# EAGLE design B Bot Cube (EAGLE 7.2.0)
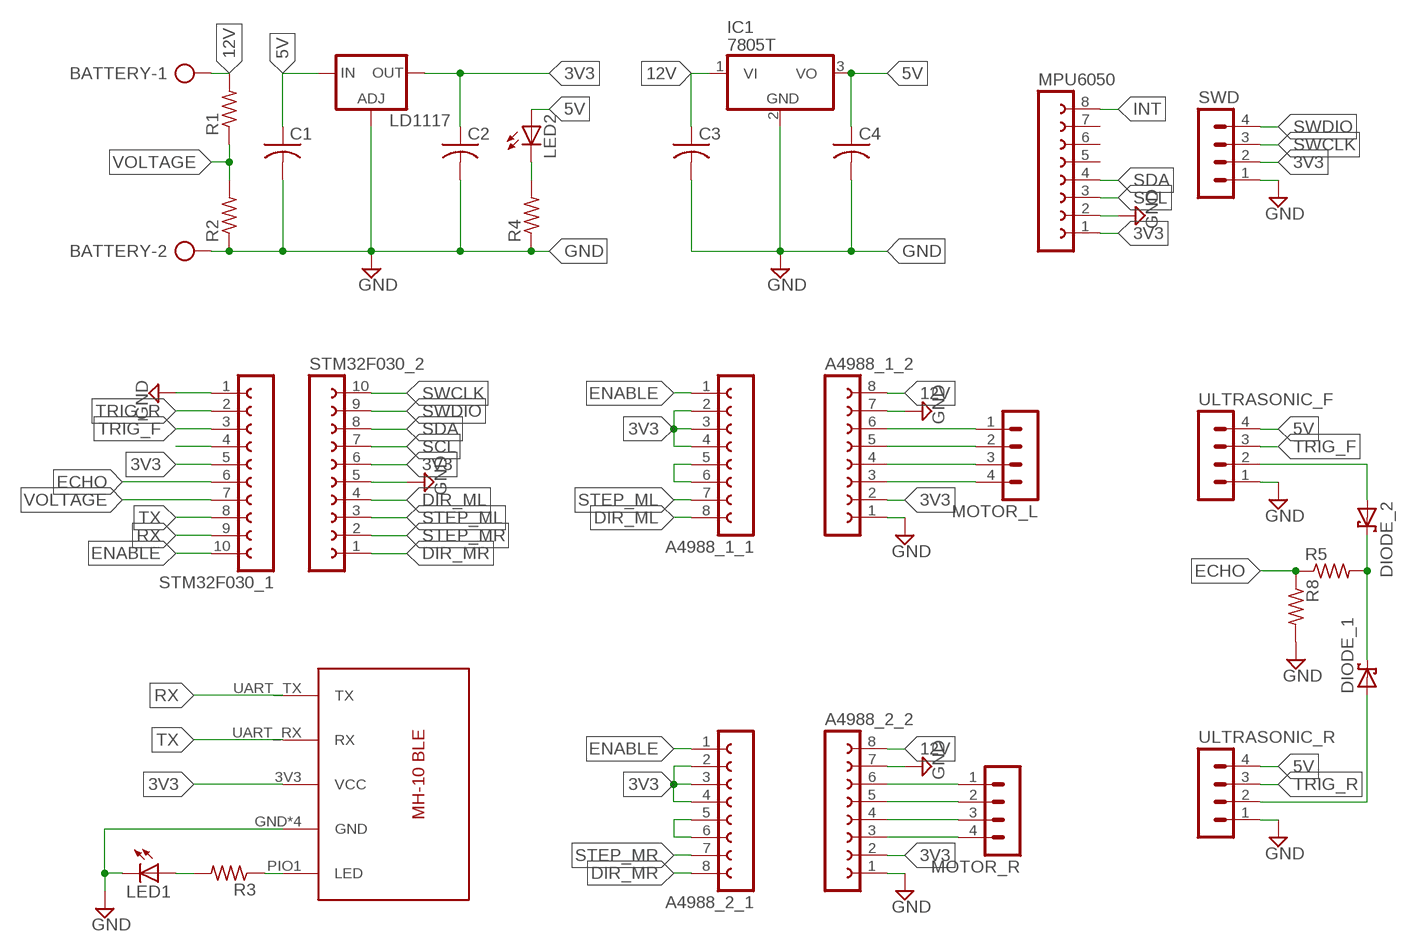
[diagram p0: schematic, sheet 1]

## Parts
A4988_1_1  FE08-1  [FE08]
A4988_1_2  FE08-1  [FE08]
A4988_2_1  FE08-1  [FE08]
A4988_2_2  FE08-1  [FE08]
BATTERY  AK500/2  [AK500/2]
C1  C-USC0805K  [C0805K]
C2  C-USC0805K  [C0805K]
C3  C-USC0805K  [C0805K]
C4  C-USC0805K  [C0805K]
DIODE_1  BAT60J  [SOD323_ST]
DIODE_2  BAT60J  [SOD323_ST]
IC1  7805T  [TO220H]
LD1117  LD117AS33TR  [SOT223]
LED1  LED-0805  [LED-805]
LED2  LED-0805  [LED-805]
MOTOR_L  MA04-1  [MA04-1]
MOTOR_R  MA04-1  [MA04-1]
MPU6050  FE08-1  [FE08]
R1  R-US_M0805  [M0805]
R2  R-US_M0805  [M0805]
R3  R-US_M0805  [M0805]
R4  R-US_M0805  [M0805]
R5  R-US_M0805  [M0805]
R8  R-US_M0805  [M0805]
STM32F030_1  FE10-1  [FE10]
STM32F030_2  FE10-1  [FE10]
SWD  MA04-1  [MA04-1]
U$1  HM-10  [HM-10]
ULTRASONIC_F  MA04-1  [MA04-1]
ULTRASONIC_R  MA04-1  [MA04-1]

## Nets
3V3: A4988_1_1.2 A4988_1_1.3 A4988_1_1.4 A4988_1_2.2 A4988_2_1.2 A4988_2_1.3 A4988_2_1.4 A4988_2_2.2 C2.1 LD1117.4(OUT) MPU6050.1 STM32F030_1.5 STM32F030_2.6 SWD.2 U$1.3V3(VCC)
5V: C1.1 C4.1 IC1.3(VO) LD1117.3(IN) LED2.A ULTRASONIC_F.4 ULTRASONIC_R.4
12V: A4988_1_2.8 A4988_2_2.8 BATTERY.1 C3.1 IC1.1(VI) R1.2
DIR_ML: A4988_1_1.8 STM32F030_2.4
DIR_MR: A4988_2_1.8 STM32F030_2.1
ECHO: R5.1 R8.1 STM32F030_1.6
ENABLE: A4988_1_1.1 A4988_2_1.1 STM32F030_1.10
GND: A4988_1_2.1 A4988_1_2.7 A4988_2_2.1 A4988_2_2.7 BATTERY.2 C1.2 C2.2 C3.2 C4.2 IC1.2(GND) LD1117.1(ADJ) LED1.C MPU6050.2 R2.1 R4.1 R8.2 STM32F030_1.1 STM32F030_2.5 SWD.1 U$1.GND U$1.GND2(GND) U$1.GND3(GND) U$1.GND4(GND) ULTRASONIC_F.1 ULTRASONIC_R.1
INT: MPU6050.8
N$2: DIODE_1.A ULTRASONIC_R.2
N$3: DIODE_2.A ULTRASONIC_F.2
N$4: DIODE_1.C DIODE_2.C R5.2
N$5: LED2.C R4.2
N$7: LED1.A R3.2
N$8: R3.1 U$1.PIO1(LED)
N$22: A4988_2_1.5 A4988_2_1.6
N$26: A4988_2_2.6 MOTOR_R.1
N$27: A4988_2_2.5 MOTOR_R.2
N$28: A4988_2_2.4 MOTOR_R.3
N$29: A4988_2_2.3 MOTOR_R.4
N$30: A4988_1_2.6 MOTOR_L.1
N$31: A4988_1_2.5 MOTOR_L.2
N$32: A4988_1_2.4 MOTOR_L.3
N$33: A4988_1_2.3 MOTOR_L.4
N$45: A4988_1_1.5 A4988_1_1.6
N$60: STM32F030_1.4
RX: STM32F030_1.9 U$1.UART_TX(TX)
SCL: MPU6050.3 STM32F030_2.7
SDA: MPU6050.4 STM32F030_2.8
STEP_ML: A4988_1_1.7 STM32F030_2.3
STEP_MR: A4988_2_1.7 STM32F030_2.2
SWCLK: STM32F030_2.10 SWD.3
SWDIO: STM32F030_2.9 SWD.4
TRIG_F: STM32F030_1.3 ULTRASONIC_F.3
TRIG_R: STM32F030_1.2 ULTRASONIC_R.3
TX: STM32F030_1.8 U$1.UART_RX(RX)
VOLTAGE: R1.1 R2.2 STM32F030_1.7
Unconnected: MPU6050.5 MPU6050.6 MPU6050.7

## Library data of the parts
A4988_1_1 A4988_1_2 A4988_2_1 A4988_2_2 MPU6050 = con-lsta:FE08-1: FEMALE HEADER; OC_FARNELL: unknown; OC_NEWARK: unknown
BATTERY = con-ptr500:AK500/2: CONNECTOR; OC_FARNELL: unknown; OC_NEWARK: unknown
C1-C4 = rcl:C-US: CAPACITOR, American symbol
DIODE_1 DIODE_2 = diode:BAT60J: Schottky barrier diode Source: www.st.com, BAT60J.pdf
IC1 = linear:78*: Positive VOLTAGE REGULATOR Source: http://cache.national.com/ds/LM/LM78L05.pdf http://www.fairchildsemi.com/ds/LM/LM7805.pdf
LD1117 = v-reg:LD117A?*: Low drop fixed and adjustable positive voltage regulators 1 A Source: http://www.st.com/stonline/products/literature/ds/7194/ld1117axx.pdf
LED1 LED2 = dp_devices:LED: Light Emitting Diode
MOTOR_L MOTOR_R SWD ULTRASONIC_F ULTRASONIC_R = con-lstb:MA04-1: PIN HEADER; OC_FARNELL: unknown; OC_NEWARK: unknown
R1-R5 R8 = resistor:R-US_: RESISTOR, American symbol
STM32F030_1 STM32F030_2 = con-lsta:FE10-1: FEMALE HEADER; OC_FARNELL: unknown; OC_NEWARK: unknown
U$1 = Kao_lbr:HM-10

## Board
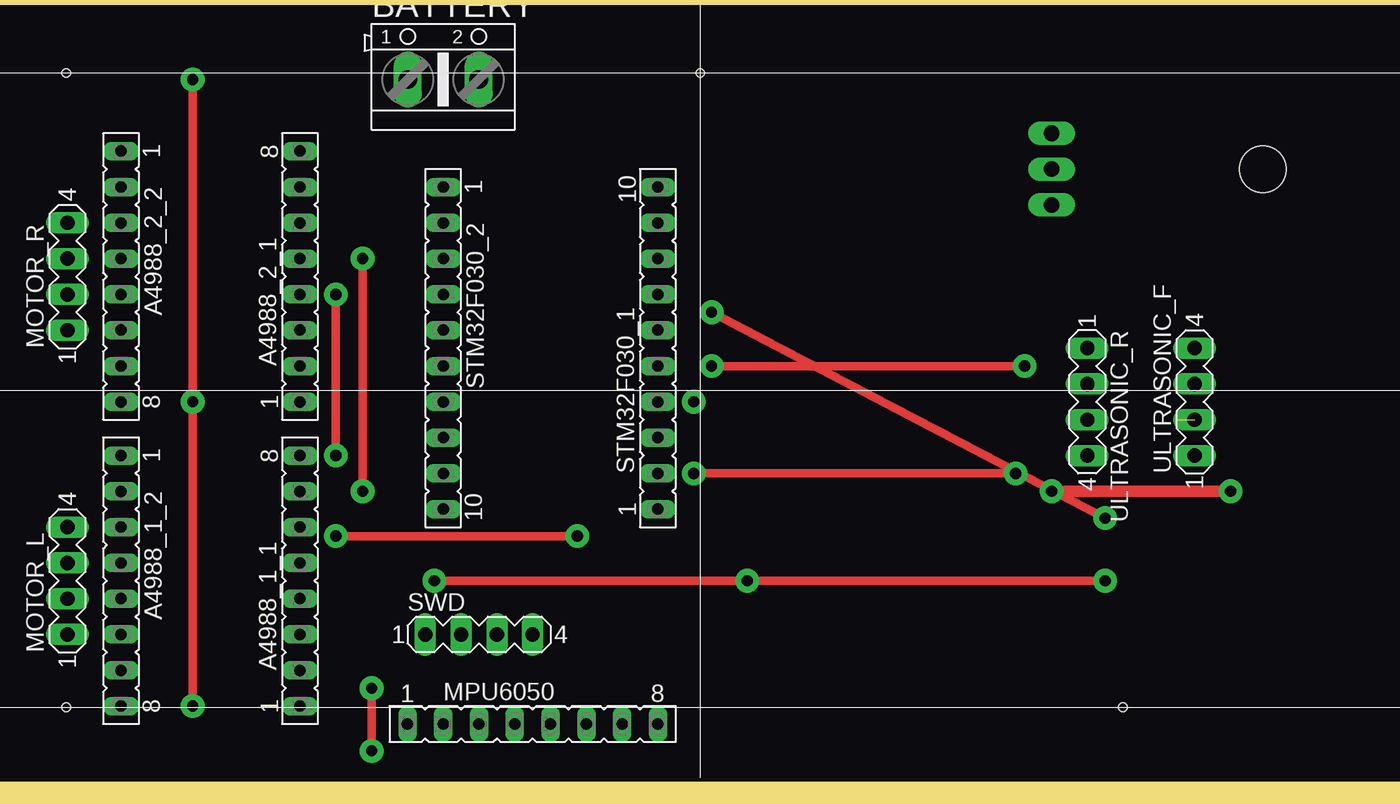
[diagram p1: board, top side]
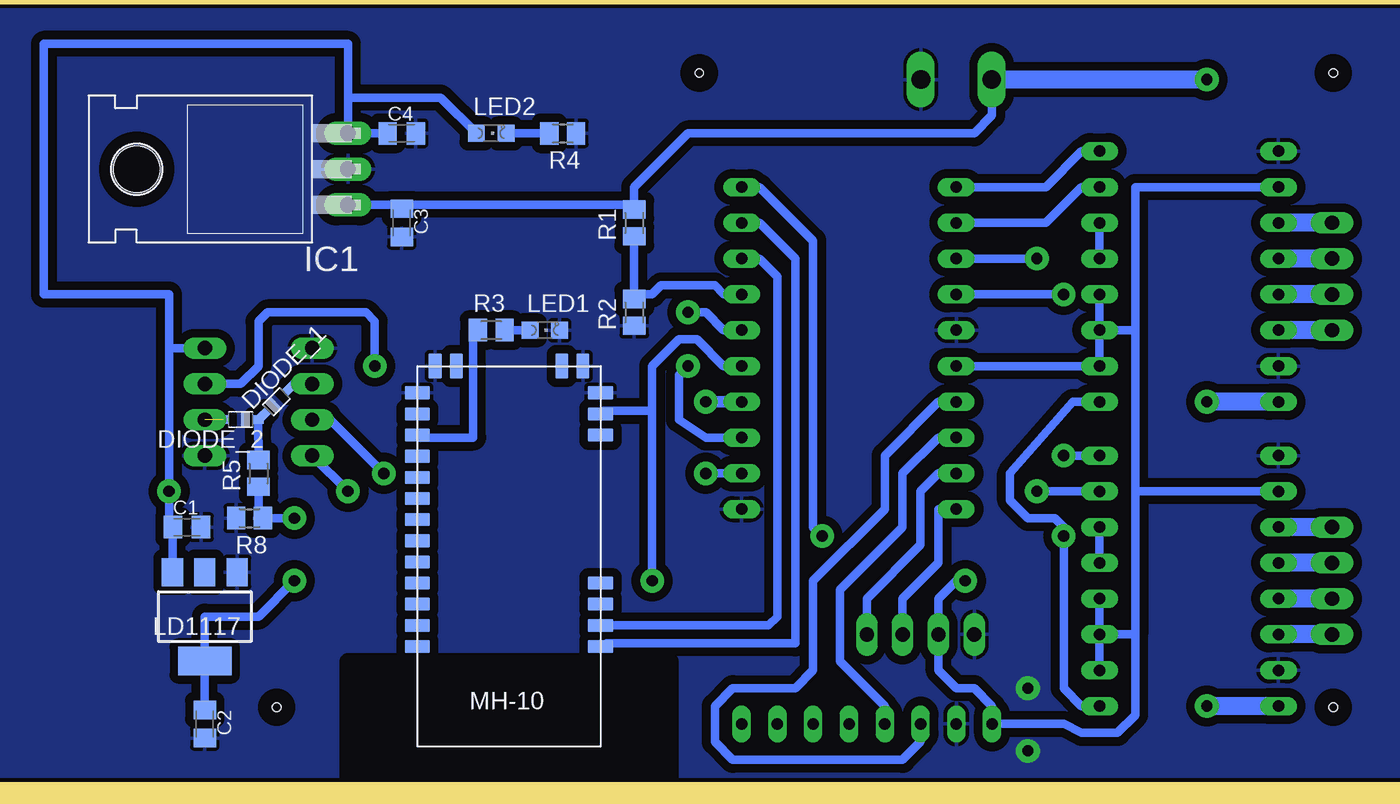
[diagram p2: board, bottom side, seen from below]

No outline drawn. Coordinates in mm, seen from the top.
Copper layers (1*16): Top 0.035mm / dielectric 1.5mm / Bottom 0.035mm
Design rules "default": minimum track width 10mil, minimum drill 24mil, track to track 8mil, track to pad 8mil, pad to pad 8mil, via to via 8mil, smd to smd 8mil, copper to edge 40mil, drill to drill 8mil, minimum pad ring 10mil, minimum via ring 8mil, stop-mask expansion 4mil, vias tented up to drill 0mil, thermal gap 10mil
Holes 0.6 mm at 50,50 5,50 80,5 5,5
bRestrict: area 52.1,-0.6 to 74.9,8.3
Milling: 4 lines

### Footprints (pad centres in the part's own frame; a part is rotated, then mirrored left to right if it is on the bottom)
FE08 = drill 0.813 long: 1 -8.89,0; 2 -6.35,0; 3 -3.81,0; 4 -1.27,0; 5 1.27,0; 6 3.81,0; 7 6.35,0; 8 8.89,0
AK500/2 = drill 1.321 long: 1 -2.515,0; 2 2.515,0
C0805K = smd 1.3 x 1.6: 1 -1,0; 2 1,0
SOD323_ST = smd 0.8 x 0.6: A 1.25,0; C -1.25,0
TO220H = drill 1.118 long: 1 -2.54,-10.16; 2 0,-10.16; 3 2.54,-10.16 | hole 3.302: 0,4.826
SOT223 = smd 1.5 x 2: 1 -2.3,-3.15; 2 0,-3.15; 3 2.3,-3.15 | smd 3.8 x 2: 4 0,3.15
LED-805 = smd 1.2 x 1.2: A 0,-1.05; C 0,1.05
MA04-1 = drill 1.016 long: 1 -3.81,0; 2 -1.27,0; 3 1.27,0; 4 3.81,0
M0805 = smd 1.3 x 1.6: 1 -0.95,0; 2 0.95,0
FE10 = drill 0.813 long: 1 -11.43,0; 2 -8.89,0; 3 -6.35,0; 4 -3.81,0; 5 -1.27,0; 6 1.27,0; 7 3.81,0; 8 6.35,0; 9 8.89,0; 10 11.43,0
HM-10 = smd 1.778 x 0.914: 3V3 -6.5,3.4; GND -6.5,1.9; GND4 6.5,1.9; PIO0 6.5,3.4; PIO1 6.5,4.9; PIO2 6.5,6.4; PIO3 6.5,7.9; PIO4 6.5,9.4; PIO5 6.5,10.9; PIO6 6.5,12.4; PIO7 6.5,13.9; PIO8 6.5,15.4; PIO9 6.5,16.9; PIO10 6.5,18.4; PIO11 6.5,19.9; RESETB -6.5,4.9; UART_CTS -6.5,16.9; UART_RTS -6.5,15.4; UART_RX -6.5,18.4; UART_TX -6.5,19.9 | smd 0.914 x 1.778: GND2 -5.25,0; GND3 5.25,0; USB_D+ 3.75,0; USB_D- -3.75,0

### Placement (x,y rotation side)
A4988_1_1  21.59,13.97 90 top
A4988_1_2  8.89,13.97 270 top
A4988_2_1  21.59,35.56 90 top
A4988_2_2  8.89,35.56 270 top
BATTERY  31.75,49.53 0 top
C1  86.36,17.78 0 bottom
C2  85.09,3.81 270 bottom
C3  71.12,39.37 270 bottom
C4  71.12,45.72 0 bottom
DIODE_1  80.01,26.67 45 bottom
DIODE_2  82.55,25.4 180 bottom
IC1  85.09,43.18 90 bottom
LD1117  85.09,11.43 180 bottom
LED1  60.96,31.75 270 bottom
LED2  64.77,45.72 270 bottom
MOTOR_L  5.08,13.97 90 top
MOTOR_R  5.08,35.56 90 top
MPU6050  38.1,3.81 0 top
R1  54.61,39.37 90 bottom
R2  54.61,33.02 90 bottom
R3  64.77,31.75 0 bottom
R4  59.69,45.72 180 bottom
R5  81.28,21.59 90 bottom
R8  81.92,18.41 180 bottom
STM32F030_1  46.99,30.48 90 top
STM32F030_2  31.75,30.48 270 top
SWD  34.29,10.16 0 top
U$1  63.5,29.21 180 bottom
ULTRASONIC_F  85.09,26.67 90 top
ULTRASONIC_R  77.47,26.67 270 top

### Tracks (layer width: path | path; a pad name or v marks a point on that pad's centre or on a via)
3V3  (via drill 0.8 pad 1.68)
  Top 0.61: v78.74,13.97 v53.34,13.97 v31.11,13.97
  Bottom 0.61: A4988_2_1.4 A4988_2_1.3 | A4988_2_1.3 A4988_2_1.2 STM32F030_2.6 | A4988_1_1.4 A4988_1_1.3 | A4988_1_1.3 A4988_1_1.2 | A4988_2_2.2 19.05,41.91 19.05,31.75 | A4988_1_2.2 19.05,20.32 | 19.05,20.32 19.05,10.16 | 19.05,20.32 19.05,31.75 | 19.05,31.75 A4988_2_1.3 | 19.05,10.16 A4988_1_1.3 | 19.05,10.16 19.05,4.45 20.32,3.17 22.86,3.17 24.13,3.81 MPU6050.1 29.21,5.08 30.48,6.35 31.75,6.35 33.02,7.62 SWD.2 33.02,12.7 31.75,13.97 v31.11,13.97 | C2.1 LD1117.4 85.09,11.43 81.28,11.43 v78.74,13.97 | STM32F030_1.5 48.26,29.21 50.16,31.11 51.44,31.11 53.34,29.21 53.34,26.04 | 53.34,26.04 v53.34,13.97 | U$1.3V3 56.77,26.04 53.34,26.04
5V  (via drill 0.8 pad 1.68)
  Top 0.813: v74.93,20.32 v87.63,20.32
  Bottom 0.61: 74.93,48.26 IC1.3 C4.1 | 74.93,48.26 74.93,52.07 96.52,52.07 96.52,34.29 87.63,34.29 87.63,30.48 | 87.63,30.48 ULTRASONIC_F.4 | LD1117.3 87.36,14.61 C1.1 87.63,18.05 v87.63,20.32 87.63,30.48 | LED2.A 68.36,48.26 74.93,48.26 | ULTRASONIC_R.4 v74.93,20.32
12V  (via drill 0.6, 0.8 pad 1.68)
  Top 0.61: v13.97,5.08 v13.97,26.67 v13.97,49.53
  Bottom 0.61: C3.1 71.12,40.64 IC1.1 54.61,40.64 | BATTERY.1 29.21,49.51 29.21,46.99 30.48,45.72 50.8,45.72 54.61,41.91 54.61,40.64 | R1.2 54.61,40.64
  Bottom 1.27: A4988_1_2.8 v13.97,5.08 | A4988_2_2.8 v13.97,26.67 | v13.97,49.53 BATTERY.1
DIR_ML  (via drill 0.6, 0.8 pad 1.68)
  Top 0.61: v24.13,22.86 v24.13,34.29
  Bottom 0.61: A4988_1_1.8 v24.13,22.86 | v24.13,34.29 STM32F030_2.4
DIR_MR
  Bottom 0.61: A4988_2_1.8 22.86,44.45 25.4,41.91 STM32F030_2.1
ECHO  (via drill 0.8 pad 1.68)
  Top 0.61: v50.8,33.02 v78.74,18.41
  Bottom 0.61: STM32F030_1.6 48.26,31.75 49.53,33.02 v50.8,33.02 | R5.1 81.28,18.41 | R8.1 v78.74,18.41
  Bottom 0.813: 81.28,18.41 R8.1
ENABLE  (via drill 0.8 pad 1.68)
  Top 0.61: v41.27,17.14 v24.13,17.14
  Bottom 0.61: A4988_1_1.1 22.86,5.08 24.13,6.35 v24.13,17.14 24.13,17.78 24.77,18.41 26.67,18.41 27.94,19.68 27.94,21.59 23.5,26.67 A4988_2_1.1 | STM32F030_1.10 45.72,41.91 41.91,38.1 41.91,17.78 v41.27,17.14
GND  (via drill 0.8 pad 1.68)
  Top 0.61: v26.67,6.35 v26.67,1.91
  pour Bottom (isolate 0.61): 0,54.61 100.33,54.61 100.33,0 0,0
N$1
  Bottom 0: 96.52,34.29 96.52,52.07 74.93,52.07
N$2
  Bottom 0.61: ULTRASONIC_R.2 78.74,27.94 DIODE_1.A
N$3  (1 unrouted)
N$4
  Bottom 0.61: DIODE_1.C 80.91,25.79 DIODE_2.C R5.2
N$5
  Bottom 0.61: R4.2 LED2.C
N$7
  Bottom 0.61: R3.2 LED1.A
N$8
  Bottom 0.61: U$1.PIO1 69.85,24.13 66.04,24.13 66.04,31.75 R3.1
N$22
  Bottom 0.61: A4988_2_1.6 A4988_2_1.5
N$26
  Bottom 1.27: MOTOR_R.1 A4988_2_2.6
N$27
  Bottom 1.27: MOTOR_R.2 A4988_2_2.5
N$28
  Bottom 1.27: MOTOR_R.3 A4988_2_2.4
N$29
  Bottom 1.27: MOTOR_R.4 A4988_2_2.3
N$30
  Bottom 1.27: MOTOR_L.1 A4988_1_2.6
N$31
  Bottom 1.27: MOTOR_L.2 A4988_1_2.5
N$32
  Bottom 1.27: MOTOR_L.3 A4988_1_2.4
N$33
  Bottom 1.27: MOTOR_L.4 A4988_1_2.3
N$45
  Bottom 0.61: A4988_1_1.6 A4988_1_1.5
N$60  (via drill 0.8 pad 1.68)
  Bottom 0.813: STM32F030_1.4 v49.53,26.67
RX
  Bottom 0.61: STM32F030_1.9 45.72,39.37 43.18,36.83 43.18,9.53 56.58,9.53 U$1.UART_TX
SCL
  Bottom 0.61: MPU6050.3 34.29,2.54 35.56,1.27 47.62,1.27 48.9,2.54 48.9,5.08 47.62,6.35 43.18,6.35 41.91,7.62 41.91,13.97 36.83,19.05 36.83,22.86 33.02,26.67 STM32F030_2.7
SDA
  Bottom 0.61: STM32F030_2.8 33.02,24.13 35.56,21.59 35.56,17.78 40.01,13.34 40.01,8.26 36.83,5.08 MPU6050.4
STEP_ML  (via drill 0.6, 0.8 pad 1.68)
  Top 0.61: v26.04,20.32 v26.04,36.83
  Bottom 0.61: A4988_1_1.7 v26.04,20.32 | v26.04,36.83 STM32F030_2.3
STEP_MR
  Bottom 0.61: A4988_2_1.7 22.86,41.91 25.4,39.37 STM32F030_2.2
SWCLK
  Bottom 0.61: STM32F030_2.10 33.02,19.05 33.02,15.24 35.56,12.7 SWD.3
SWDIO
  Bottom 0.61: STM32F030_2.9 33.02,21.59 34.29,20.32 34.29,16.51 38.1,12.7 SWD.4
TRIG_F  (via drill 0.8 pad 1.68)
  Top 0.61: v50.8,29.21 v73.03,29.21
  Bottom 0.61: STM32F030_1.3 49.53,24.13 51.44,25.4 51.44,28.57 v50.8,29.21 | v73.03,29.21 73.03,32.38 73.66,33.02 80.64,33.02 81.28,32.38 81.28,29.21 82.55,27.94 ULTRASONIC_F.3
TRIG_R  (via drill 0.8 pad 1.68)
  Top 0.61: v49.53,21.59 v72.39,21.59
  Bottom 0.61: STM32F030_1.2 v49.53,21.59 | v72.39,21.59 76.2,25.4 ULTRASONIC_R.3
TX
  Bottom 0.61: U$1.UART_RX 45.1,10.81 44.45,11.43 44.45,35.56 45.72,36.83 STM32F030_1.8
VOLTAGE
  Bottom 0.61: 54.61,34.29 R2.2 | R1.1 54.61,34.29 | 54.61,34.29 53.34,34.29 52.7,34.92 48.9,34.92 48.26,34.29 STM32F030_1.7